# Altium schematic sheet panneau_sheet.SchDoc
size A4
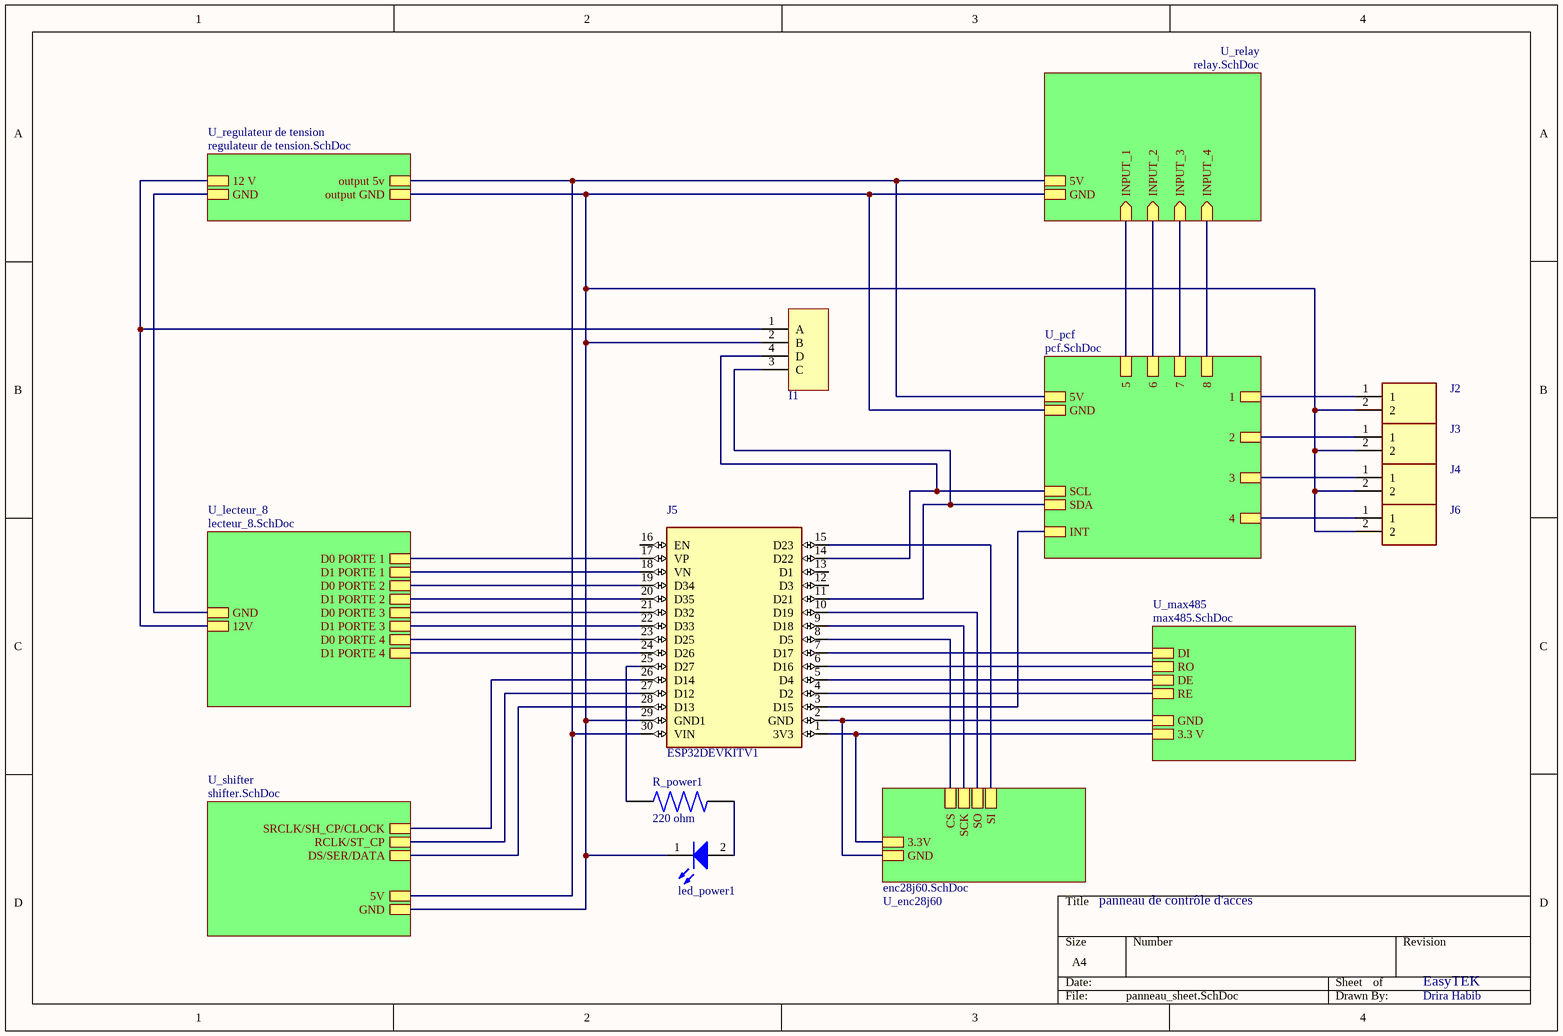
[diagram p0: panneau_sheet.SchDoc]

## Parts
I1  Header 4  [JST_4_PIN]  (value not drawn)
J2  1546215-2  [15462152]  (value not drawn)
J3  1546215-2  [15462152]  (value not drawn)
J4  1546215-2  [15462152]  (value not drawn)
J5  ESP32DEVKITV1  [ESP32-DEVKITV1_3D]
J6  1546215-2  [15462152]  (value not drawn)
led_power1  Infrared, 1.5V, 35°  [WL-TIRW_D5.8H8.6]  (value not drawn)
R_power1  value 220 ohm  [RES_ERA2APB221X]  (hidden comment: ERA2APB221X)

## Sub-sheets
U_enc28j60 = enc28j60.SchDoc: 3.3V, CS, SI, GND, SCK, SO
U_lecteur_8 = lecteur_8.SchDoc: D1 PORTE 1, D0 PORTE 1, GND, 12V, D1 PORTE 2, D0 PORTE 2, D1 PORTE 3, D0 PORTE 3, D1 PORTE 4, D0 PORTE 4
U_max485 = max485.SchDoc: DI, DE, RE, RO, 3.3 V, GND
U_pcf = pcf.SchDoc: INT, SDA, GND, SCL, 5V, 1, 2, 3, 4, 5, 6, 7, 8
U_regulateur de tension = regulateur de tension.SchDoc: output 5v, output GND, 12 V, GND
U_relay = relay.SchDoc: INPUT_4 (in), INPUT_3 (in), INPUT_2 (in), GND, INPUT_1 (in), 5V
U_shifter = shifter.SchDoc: SRCLK/SH_CP/CLOCK, DS/SER/DATA, RCLK/ST_CP, GND, 5V

## Nets
NetI1_1: I1.1(A) ; sheet U_lecteur_8/12V, sheet U_regulateur de tension/12 V
NetI1_2: I1.2(B) J2.2 J3.2 J4.2 J5.29(GND1) J6.2 led_power1.1(K) ; sheet U_regulateur de tension/output GND, sheet U_pcf/GND, sheet U_relay/GND, sheet U_shifter/GND
NetI1_3: I1.3(C) J5.11(D21) ; sheet U_pcf/SDA
NetI1_4: I1.4(D) J5.14(D22) ; sheet U_pcf/SCL
NetJ2_1: J2.1 ; sheet U_pcf/1
NetJ3_1: J3.1 ; sheet U_pcf/2
NetJ4_1: J4.1 ; sheet U_pcf/3
NetJ5_1: J5.1(3V3) ; sheet U_enc28j60/3.3V, sheet U_max485/3.3 V
NetJ5_2: J5.2(GND) ; sheet U_enc28j60/GND, sheet U_max485/GND
NetJ5_3: J5.3(D15) ; sheet U_pcf/INT
NetJ5_4: J5.4(D2) ; sheet U_max485/RE
NetJ5_5: J5.5(D4) ; sheet U_max485/DE
NetJ5_6: J5.6(D16) ; sheet U_max485/RO
NetJ5_7: J5.7(D17) ; sheet U_max485/DI
NetJ5_8: J5.8(D5) ; sheet U_enc28j60/CS
NetJ5_9: J5.9(D18) ; sheet U_enc28j60/SCK
NetJ5_10: J5.10(D19) ; sheet U_enc28j60/SO
NetJ5_15: J5.15(D23) ; sheet U_enc28j60/SI
NetJ5_17: J5.17(VP) ; sheet U_lecteur_8/D0 PORTE 1
NetJ5_18: J5.18(VN) ; sheet U_lecteur_8/D1 PORTE 1
NetJ5_19: J5.19(D34) ; sheet U_lecteur_8/D0 PORTE 2
NetJ5_20: J5.20(D35) ; sheet U_lecteur_8/D1 PORTE 2
NetJ5_21: J5.21(D32) ; sheet U_lecteur_8/D0 PORTE 3
NetJ5_22: J5.22(D33) ; sheet U_lecteur_8/D1 PORTE 3
NetJ5_23: J5.23(D25) ; sheet U_lecteur_8/D0 PORTE 4
NetJ5_24: J5.24(D26) ; sheet U_lecteur_8/D1 PORTE 4
NetJ5_25: J5.25(D27) R_power1.1
NetJ5_26: J5.26(D14) ; sheet U_shifter/SRCLK/SH_CP/CLOCK
NetJ5_27: J5.27(D12) ; sheet U_shifter/RCLK/ST_CP
NetJ5_28: J5.28(D13) ; sheet U_shifter/DS/SER/DATA
NetJ5_30: J5.30(VIN) ; sheet U_regulateur de tension/output 5v, sheet U_pcf/5V, sheet U_relay/5V, sheet U_shifter/5V
NetJ6_1: J6.1 ; sheet U_pcf/4
Netled_power1_2: led_power1.2(A) R_power1.2
(unnamed): sheet U_lecteur_8/GND, sheet U_regulateur de tension/GND
(unnamed): sheet U_pcf/5, sheet U_relay/INPUT_1
(unnamed): sheet U_pcf/6, sheet U_relay/INPUT_2
(unnamed): sheet U_pcf/7, sheet U_relay/INPUT_3
(unnamed): sheet U_pcf/8, sheet U_relay/INPUT_4

Not connected (* = marked no-connect by the designer): J5 12(D3) 13(D1) 16(EN)

## Notes on the sheet
- panneau de contrôle d'acces
- EasyTEK
- Drira Habib

## Library data of the parts
I1 = Connector_4Pin
J2-J4 J6 = 1546215-2: Connector; Manufacturer_Name: TE Connectivity; Datasheet Link: https://www.te.com/commerce/DocumentDelivery/DDEController?Action=srchrtrv&DocNm=1546215&DocType=Customer+Drawing&DocLang=English; Height: 10.3mm; Manufacturer_Part_Number: 1546215-2; Mouser Part Number: 571-1546215-2; Mouser Price/Stock: https://www.mouser.co.uk/ProductDetail/TE-Connectivity/1546215-2?qs=Lxq28tKK6BPmJFoAOY7Ljw%3D%3D; Arrow Part Number: 1546215-2; Arrow Price/Stock: https://www.arrow.com/en/products/1546215-2/te-connectivity?region=nac
J5 = ESP32DEVKITV1: Dual core, Wi-Fi: 2.4 GHz up to 150 Mbits/s,BLE (Bluetooth Low Energy) and legacy Bluetooth, 32 bits, Up to 240 MHz; MF: Do it; Check_prices: https://www.snapeda.com/parts/ESP32%20DEVKIT%20V1/Do%20it/view-part/5659245/?ref=eda; Value: *; SnapEDA_Link: https://www.snapeda.com/parts/ESP32%20DEVKIT%20V1/Do%20it/view-part/5659245/?ref=snap; Package: Package; Availability: Unavailable; Price: None; MP: ESP32 DEVKIT V1
led_power1 = 15400585A3590: WL-TIRW THT Infrared Round Waterclear, D5.8 x H8.6mm, 85mW/sr, Infrared, 1.5V, 35°; Manufacturer: Wurth Elektronik; Centroid Wavelength: 845nm; Chip Technology: AlGaAs; Peak Wavelength: 850nm; Manufacturer Part Number: 15400585A3590; Category: Infrared LEDs; Match Code: WL-TIRW; ComponentLink1Description: Website Link; ComponentLink1URL: https://www.we-online.com/redexpert/article/15400585A3590?ad; ComponentLink2Description: Datasheet Link; ComponentLink2URL: https://www.we-online.com/redexpert/spec/15400585A3590?ad; Mount: Through Hole; Operating Temperature Max: 85°C; Operating Temperature Min: -40°C; Packaging: Bulk; Height: 8.6mm; Diameter: 5.8mm; Emitting Color: Infrared; Forward Voltage: 1.5V; Radiant Intensity: 85mW/sr; Viewing Angle: 35°
R_power1 = ERA2APB221X: Availability: Unavailable; MP: ERA2APB221X; Price: None; Package: None